# EasyEDA Pro project ProProject_阵列式磁场检测仪_2024-06-02.epro, board PCB1
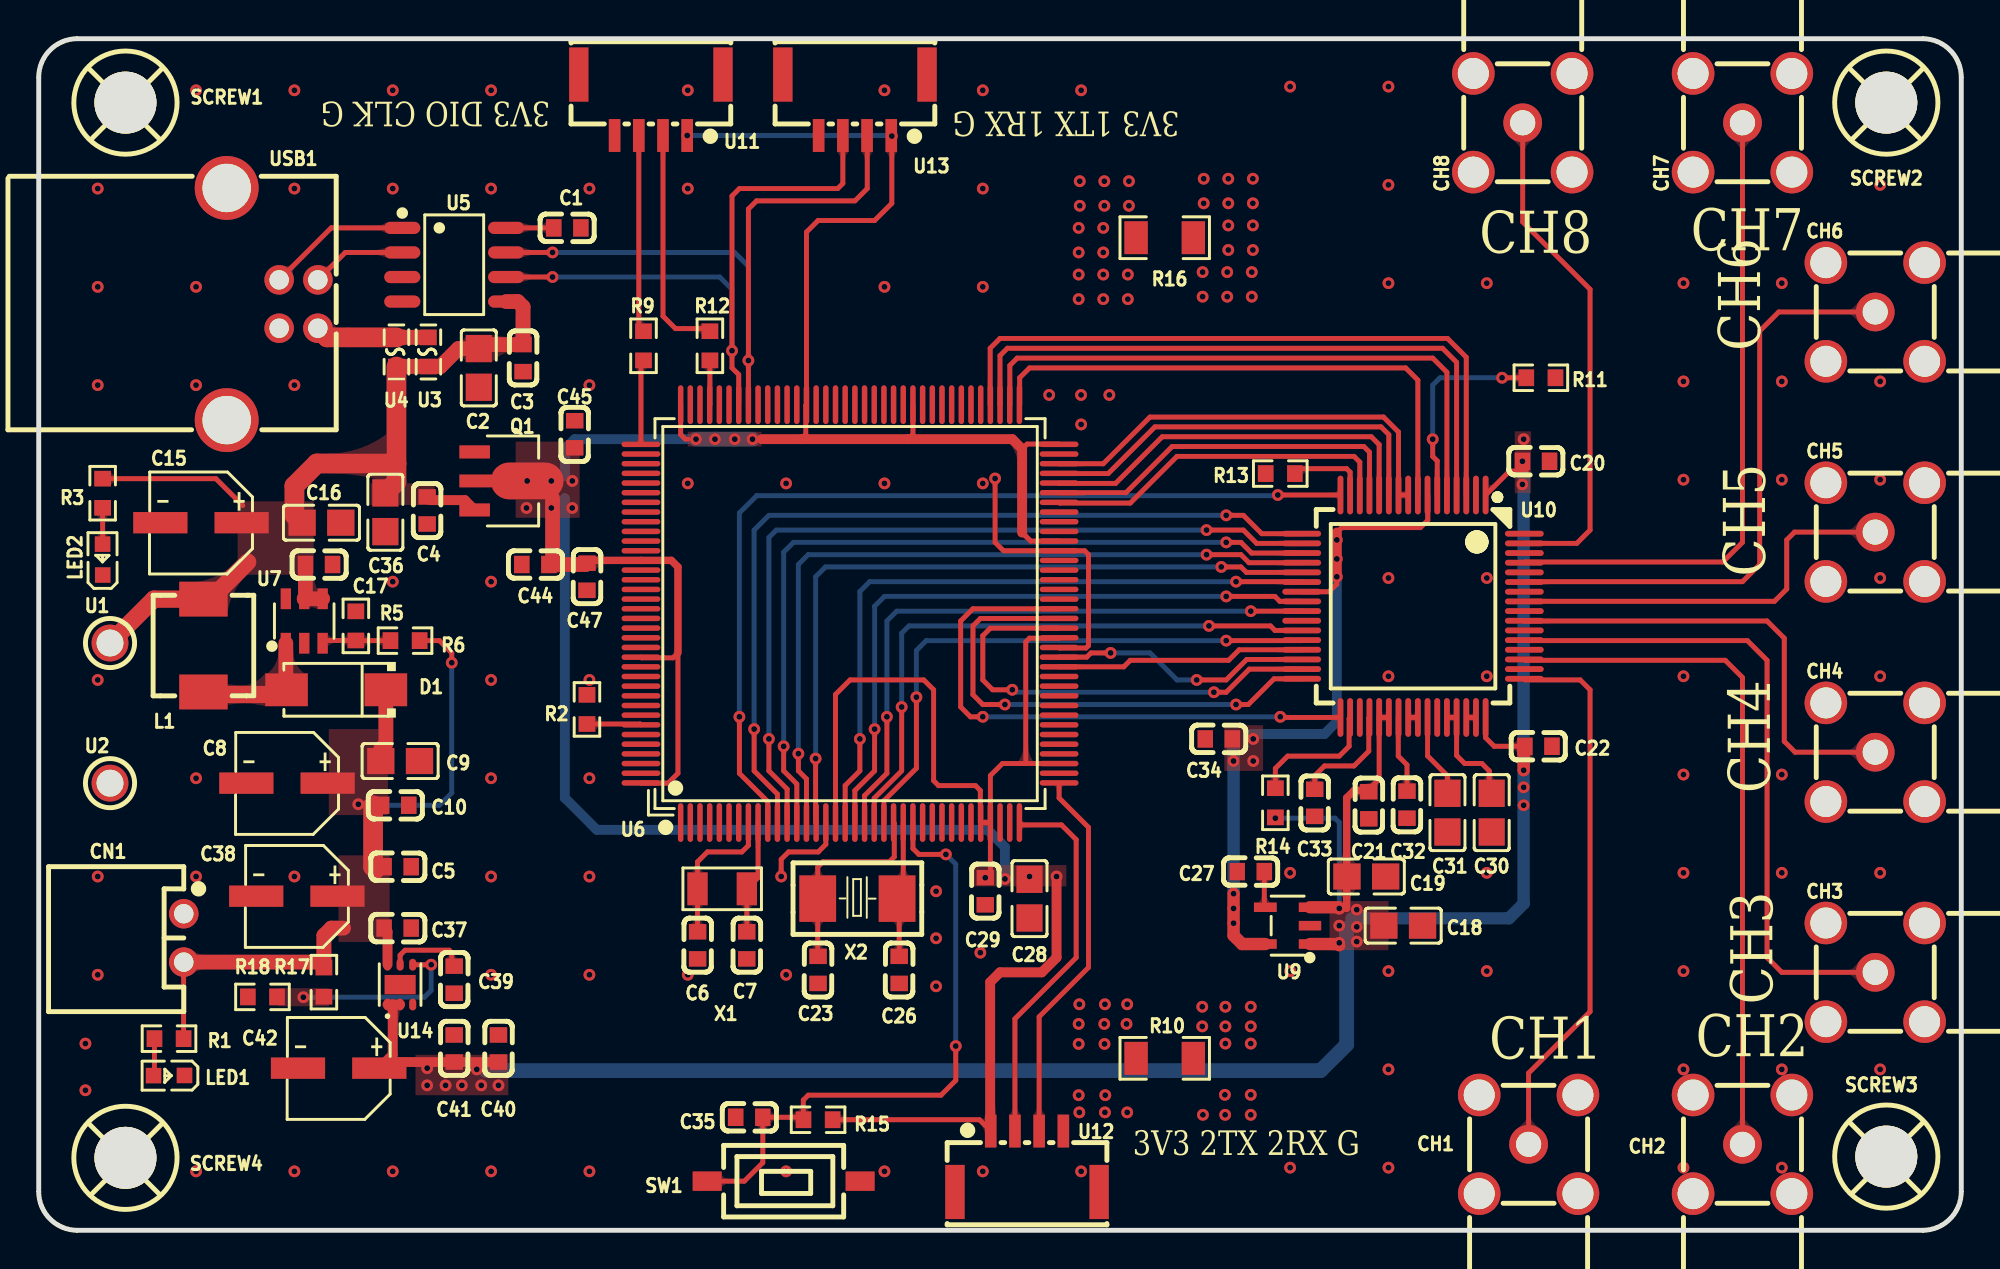
[diagram p6: board, top side]
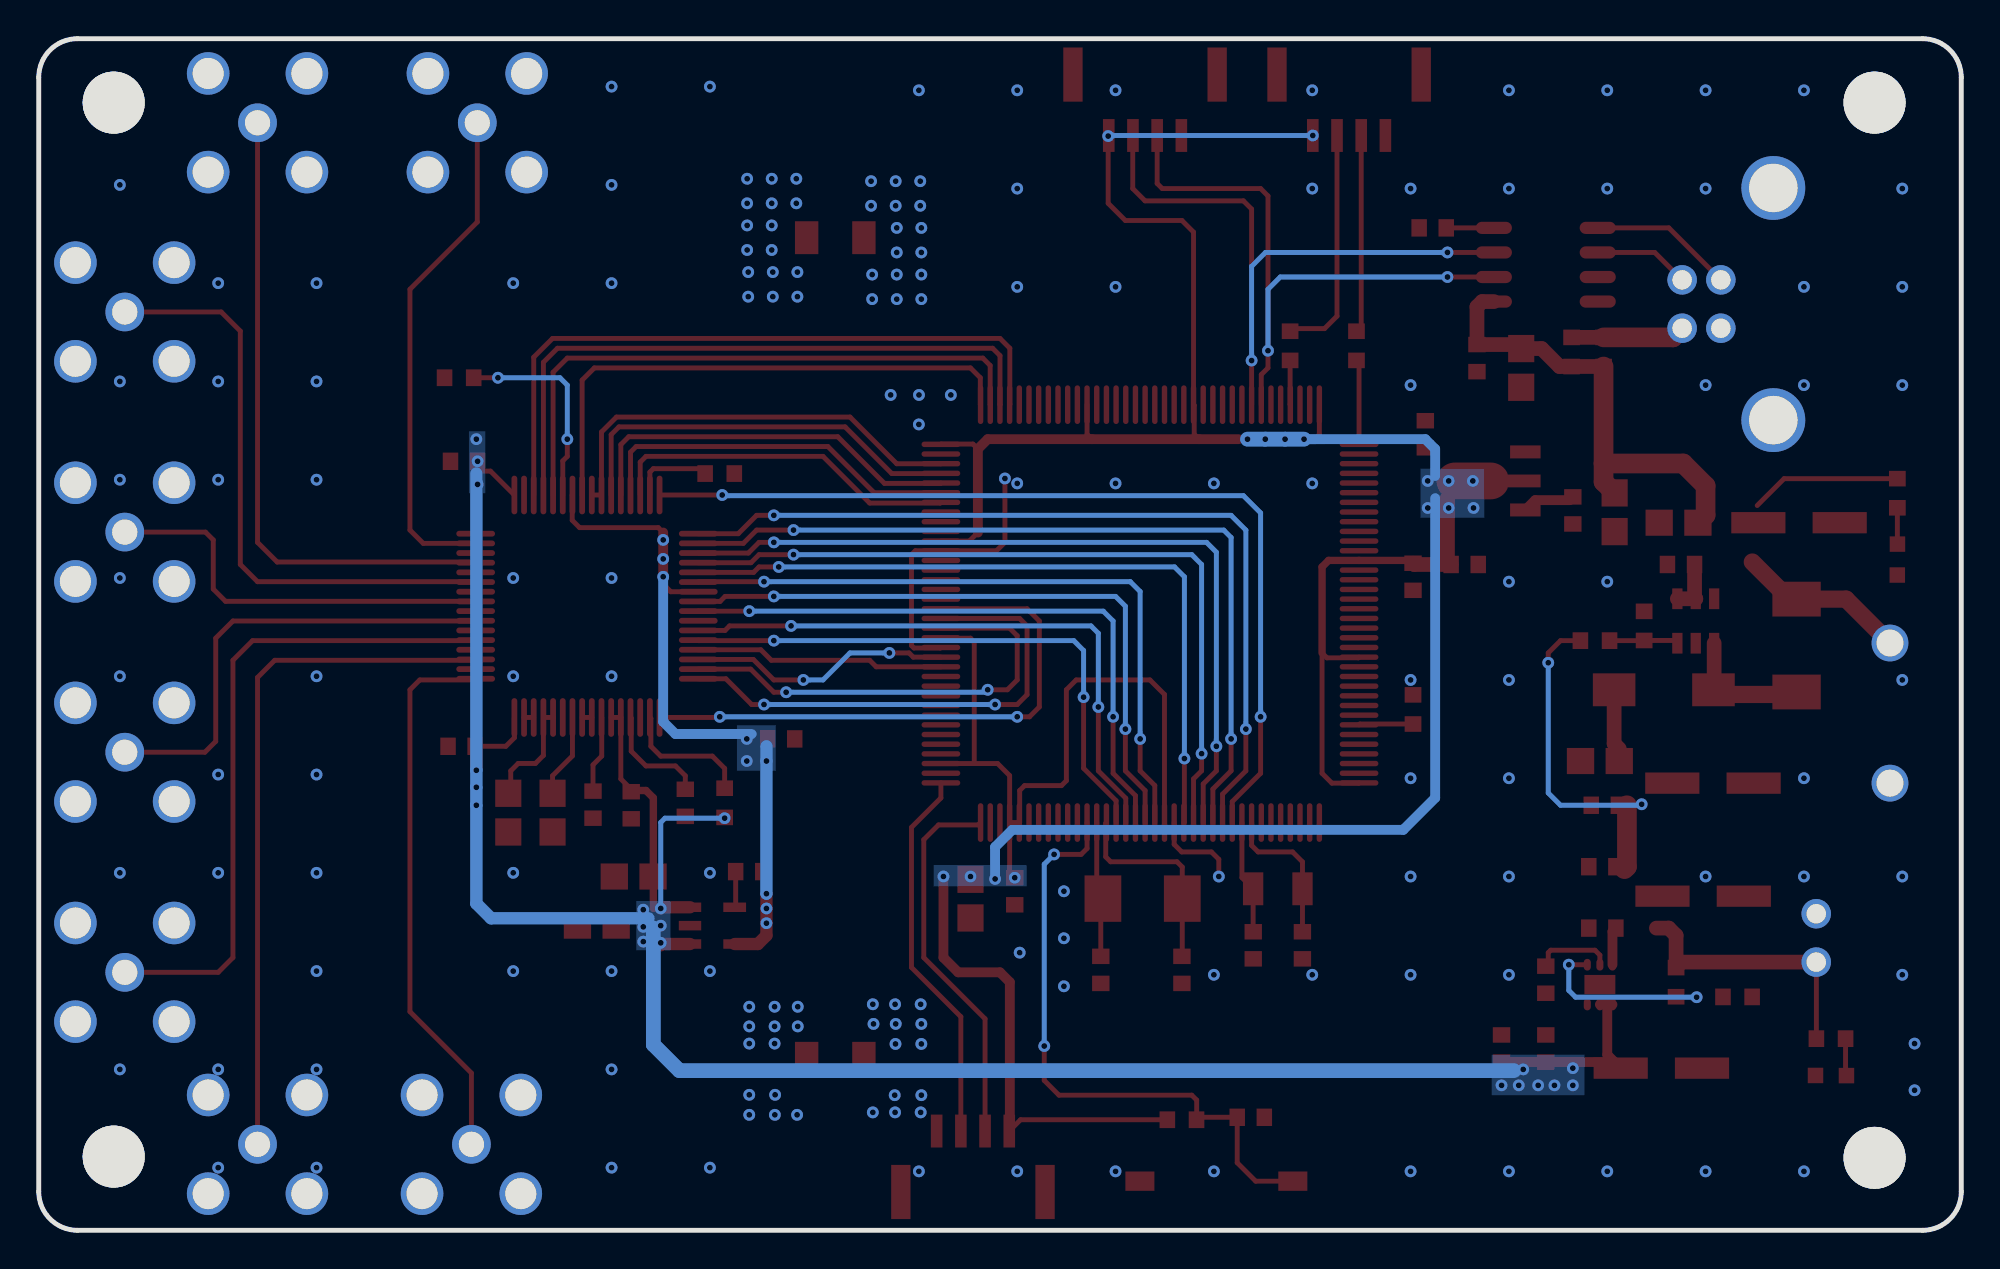
[diagram p7: board, bottom side, seen from below]

Outline 99.31 x 61.59 mm; copper layers: Top Layer, Bottom Layer. Coordinates in mm from the lower left corner of the outline.
Outline path: 0,59.59 0,2 arc(0.59,0.59) 2,0 97.31,0 arc(98.73,0.59) 99.31,2 99.31,59.59 arc(98.73,61.01) 97.31,61.59 2,61.59 arc(0.59,61.01) 0,59.59
Stack: Top Layer 0.035mm / Dielectric1 1.51mm FR4 er 4.5 / Bottom Layer 0.035mm

## Design rules (mm)
template: 自定义配置
spacing copperThickness1oz (default): track to track 0.102, other pairs 0.152 to 0.3
spacing copperThickness2oz: track to track 0.203, other pairs 0.152 to 0.3
track width copperThickness1oz (default): min 0.127, default 0.254, max 2.54
track width copperThickness2oz: min 0.203, default 0.254, max 2.54
differential pair differentialPair (default): width min 0.127, default 0.254, max 2.54; gap min 0.152, default 0.152
via viaSize (default): diameter min 0.5, default 0.61, max 10; hole min 0.3, default 0.305, max 6.3

## Placement (name value [footprint] x y rotation side)
C1  100nF  [C0603]  27.31 51.82 0 top
C2  10uF  [C0805]  22.73 44.58 270 top
C3  100nF  [C0603]  25.02 45.09 270 top
C4  100nF  [C0603]  20.07 37.21 90 top
C5  2.2uF  [C0603]  18.54 18.8 180 top
C6  6pF  [c0603]  34.04 14.73 270 top
C7  6pF  [C0603]  36.58 14.73 270 top
C8  22uF  [CAP-SMD_BD5.0-L5.3-W5.3-LS6.0-FD]  12.83 23.11 180 top
C9  10uF  [C0805]  18.67 24.26 180 top
C10  100nF  [C0603]  18.42 21.97 180 top
C15  22uF  [CAP-SMD_BD5.0-L5.3-W5.3-LS6.0-FD]  8.38 36.58 180 top
C16  10uF  [C0805]  14.61 36.58 0 top
C17  100nF  [C0603]  14.48 34.42 180 top
C18  10uF  [C0805]  70.49 15.75 180 top
C19  10uF  [C0805]  68.58 18.29 180 top
C20  100nF  [C0603]  77.34 39.75 0 top
C21  100nF  [C0603]  68.71 21.97 270 top
C22  100nF  [C0603]  77.47 25.02 0 top
C23  22pF  [C0603]  40.26 13.46 90 top
C26  22pF  [C0603]  44.45 13.46 90 top
C27  22nF  [C0603]  62.61 18.54 0 top
C28  10uF  [C0805]  51.18 17.15 270 top
C29  100nF  [C0603]  48.9 17.53 270 top
C30  10uF  [C0805]  75.06 21.59 90 top
C31  10uF  [C0805]  72.77 21.59 90 top
C32  100nF  [C0603]  70.68 22 90 top
C33  100nF  [C0603]  65.91 22.1 90 top
C34  100nF  [C0603]  60.96 25.4 0 top
C35  100nF  [C0603]  36.7 5.84 180 top
C36  10uF  [C0805]  17.91 37.12 270 top
C37  100nF  [C0603]  18.54 15.62 180 top
C38  10uF  [CAP-SMD_BD5.0-L5.3-W5.3-FD]  13.33 17.27 180 top
C39  1nF  [C0603]  21.46 12.95 270 top
C40  100nF  [C0603]  23.75 9.4 270 top
C41  2.2uF  [C0603]  21.46 9.4 270 top
C42  10uF  [CAP-SMD_BD5.0-L5.3-W5.3-FD]  15.49 8.38 180 top
C44  100nF  [C0603]  25.65 34.42 180 top
C45  100nF  [C0603]  27.69 41.15 90 top
C47  100nF  [C0603]  28.32 33.78 270 top
CH1  BWSMA-KWE-Z001  [SMA-TH_BWSMA-KWE-Z001]  76.96 4.44 270 top
CH2  BWSMA-KWE-Z001  [SMA-TH_BWSMA-KWE-Z001]  88.01 4.44 270 top
CH3  BWSMA-KWE-Z001  [SMA-TH_BWSMA-KWE-Z001]  94.87 13.34 0 top
CH4  BWSMA-KWE-Z001  [SMA-TH_BWSMA-KWE-Z001]  94.87 24.71 0 top
CH5  BWSMA-KWE-Z001  [SMA-TH_BWSMA-KWE-Z001]  94.87 36.09 0 top
CH6  BWSMA-KWE-Z001  [SMA-TH_BWSMA-KWE-Z001]  94.87 47.47 0 top
CH7  BWSMA-KWE-Z001  [SMA-TH_BWSMA-KWE-Z001]  88.01 57.25 90 top
CH8  BWSMA-KWE-Z001  [SMA-TH_BWSMA-KWE-Z001]  76.66 57.25 90 top
CN1  XH2.54-2P_H弯针插座  [CONN-TH_2P-P2.5_XH2.54-2P_H]  7.49 15.11 270 top
D1  SS14  [SMA_L4.2-W2.6-LS5.3-RD]  15.37 27.94 180 top
L1  15uH  [IND-SMD_L5.2-W5.2_YSPI0530]  8.51 30.23 270 top
LED1  KT-0603R  [LED0603-RD]  6.73 8 180 top
LED2  KT-0603R  [LED0603-RD]  3.3 34.67 90 top
Q1  AMS1117-3.3V  [SOT-89-3_L4.5-W2.5-P1.50-LS4.2-BR]  23.88 38.73 180 top
R1  24kΩ  [R0603]  6.73 9.91 0 top
R2  10kΩ  [R0603]  28.32 26.92 90 top
R3  10K  [R0603]  3.3 38.1 270 top
R5  1kΩ  [R0603]  16.38 31.24 270 top
R6  14kΩ  [R0603]  18.92 30.48 0 top
R9  51Ω  [R0603]  31.24 45.72 90 top
R10  0Ω  [R1206]  58.17 8.89 180 top
R11  10kΩ  [R0603]  77.6 44.07 180 top
R12  51Ω  [R0603]  34.67 45.72 90 top
R13  10kΩ  [R0603]  64.13 39.12 0 top
R14  10kΩ  [R0603]  63.88 22.1 270 top
R15  10kΩ  [R0603]  40.26 5.72 0 top
R16  0Ω  [R1206]  58.17 51.31 180 top
R17  150kΩ  [R0603]  14.73 12.83 270 top
R18  24kΩ  [R0603]  11.56 12.06 180 top
SCREW1  -  [M3螺丝]  4.54 58.23 0 top
SCREW2  -  [M3螺丝]  95.5 58.23 0 top
SCREW3  -  [M3螺丝]  95.5 3.75 0 top
SCREW4  -  [M3螺丝]  4.54 3.68 0 top
SW1  TS-1092S-B3D2-G  [SW-SMD_L6.1-W3.6-LS7.9]  38.48 2.54 180 top
U1  5003  [TEST-TH_BD2.54-P1.39]  3.68 30.36 0 top
U2  5003  [TEST-TH_BD2.54-P1.39]  3.68 23.11 0 top
U3  0467.250NRHF  [F0603]  20.13 45.4 270 top
U4  0467.250NRHF  [F0603]  18.48 45.4 270 top
U5  CH340N  [SOP-8_L4.9-W3.9-P1.27-LS6.0-BL]  21.46 49.91 270 top
U6  STM32F103ZET6  [LQFP-144_L20.0-W20.0-P0.50-LS22.0-BL]  41.91 31.88 0 top
U7  MT3608  [SOT-23-6_L2.9-W1.6-P0.95-LS2.8-BL]  13.72 31.5 0 top
U9  RT9193-33GB  [SOT-23-5_L3.0-W1.7-P0.95-LS2.8-BL]  64.52 15.75 90 top
U10  AD7606BSTZ  [LQFP-64_L10.0-W10.0-P0.50-LS12.0-BL]  70.99 32.26 180 top
U11  WAFER-GH1.25-4PWB  [CONN-SMD_4P-P1.25_XUNPU_WAFER-GH1.25-4PWB]  31.62 58.17 180 top
U12  WAFER-GH1.25-4PWB  [CONN-SMD_4P-P1.25_XUNPU_WAFER-GH1.25-4PWB]  51.05 3.56 0 top
U13  WAFER-GH1.25-4PWB  [CONN-SMD_4P-P1.25_XUNPU_WAFER-GH1.25-4PWB]  42.16 58.17 180 top
U14  SGM2211-5.0XTDI6G/TR  [TDFN-6_L2.0-W2.0-P0.65-BL-EP]  18.67 12.7 0 top
USB1  USB-B01  [USB-B-TH_USB-B01]  12.06 47.88 90 top
X1  32.768kHz  [crystal-smd_l3.2-w1.5-1]  35.31 17.65 180 top
X2  8MHz  [CRYSTAL-SMD_L5.0-W3.2]  42.29 17.15 180 top

## Footprints (pads in the part's own frame, mm; a bottom-side part is the same pattern mirrored in y, then rotated)
C0603
  rect 0.8x0.9 smd: 1(-0.7,0) 2(0.7,0)
c0603
  rect 0.8x0.9 smd: 1(-0.7,0) 2(0.7,0)
C0805
  rect 1.41x1.35 smd: 1(-1,0) 2(1,0)
CAP-SMD_BD5.0-L5.3-W5.3-FD
  rect 2.8x1.1 smd: 1(-2.1,0) 2(2.1,0)
CAP-SMD_BD5.0-L5.3-W5.3-LS6.0-FD
  rect 2.8x1.1 smd: 1(-2.1,0) 2(2.1,0)
CONN-SMD_4P-P1.25_XUNPU_WAFER-GH1.25-4PWB
  rect 0.6x1.7 smd: 1(-1.875,1.575) 2(-0.625,1.575) 3(0.625,1.575) 4(1.875,1.575)
  rect 1x2.8 smd: 5(3.725,-1.575) 6(-3.725,-1.575)
CONN-TH_2P-P2.5_XH2.54-2P_H
  round 1.524 hole 1: 1(-1.25,0) 2(1.25,0)
crystal-smd_l3.2-w1.5-1
  rect 1.05x1.7 smd: 1(-1.275,0) 2(1.275,0)
CRYSTAL-SMD_L5.0-W3.2
  rect 1.9x2.4 smd: 1(-2.05,0) 2(2.05,0)
F0603
  rect 0.806x0.864 smd: 1(-0.753,0) 2(0.753,0)
IND-SMD_L5.2-W5.2_YSPI0530
  rect 1.8x2.5 smd: 1(-2.4,0) 2(2.4,0)
LED0603-RD
  rect 0.8x0.8 smd: 1(-0.799,-0.004) 2(0.799,0.004)
LQFP-64_L10.0-W10.0-P0.50-LS12.0-BL
  oval 0.3x2 smd: 1(-3.75,-5.75) 2(-3.25,-5.75) 3(-2.75,-5.75) 4(-2.25,-5.75) 5(-1.75,-5.75) 6(-1.25,-5.75) 7(-0.75,-5.75) 8(-0.25,-5.75) 9(0.25,-5.75) 10(0.75,-5.75) 11(1.25,-5.75) 12(1.75,-5.75) 13(2.25,-5.75) 14(2.75,-5.75) 15(3.25,-5.75) 16(3.75,-5.75) 33(3.75,5.75) 34(3.25,5.75) 35(2.75,5.75) 36(2.25,5.75) 37(1.75,5.75) 38(1.25,5.75) 39(0.75,5.75) 40(0.25,5.75) 41(-0.25,5.75) 42(-0.75,5.75) 43(-1.25,5.75) 44(-1.75,5.75) 45(-2.25,5.75) 46(-2.75,5.75) 47(-3.25,5.75) 48(-3.75,5.75)
  oval 2x0.3 smd: 17(5.75,-3.75) 18(5.75,-3.25) 19(5.75,-2.75) 20(5.75,-2.25) 21(5.75,-1.75) 22(5.75,-1.25) 23(5.75,-0.75) 24(5.75,-0.25) 25(5.75,0.25) 26(5.75,0.75) 27(5.75,1.25) 28(5.75,1.75) 29(5.75,2.25) 30(5.75,2.75) 31(5.75,3.25) 32(5.75,3.75) 49(-5.75,3.75) 50(-5.75,3.25) 51(-5.75,2.75) 52(-5.75,2.25) 53(-5.75,1.75) 54(-5.75,1.25) 55(-5.75,0.75) 56(-5.75,0.25) 57(-5.75,-0.25) 58(-5.75,-0.75) 59(-5.75,-1.25) 60(-5.75,-1.75) 61(-5.75,-2.25) 62(-5.75,-2.75) 63(-5.75,-3.25) 64(-5.75,-3.75)
LQFP-144_L20.0-W20.0-P0.50-LS22.0-BL
  oval 0.28x2 smd: 1(-8.75,-10.8) 2(-8.25,-10.8) 3(-7.75,-10.8) 4(-7.25,-10.8) 5(-6.75,-10.8) 6(-6.25,-10.8) 7(-5.75,-10.8) 8(-5.25,-10.8) 9(-4.75,-10.8) 10(-4.25,-10.8) 11(-3.75,-10.8) 12(-3.25,-10.8) 13(-2.75,-10.8) 14(-2.25,-10.8) 15(-1.75,-10.8) 16(-1.25,-10.8) 17(-0.75,-10.8) 18(-0.25,-10.8) 19(0.25,-10.8) 20(0.75,-10.8) 21(1.25,-10.8) 22(1.75,-10.8) 23(2.25,-10.8) 24(2.75,-10.8) 25(3.25,-10.8) 26(3.75,-10.8) 27(4.25,-10.8) 28(4.75,-10.8) 29(5.25,-10.8) 30(5.75,-10.8) 31(6.25,-10.8) 32(6.75,-10.8) 33(7.25,-10.8) 34(7.75,-10.8) 35(8.25,-10.8) 36(8.75,-10.8) 73(8.75,10.8) 74(8.25,10.8) 75(7.75,10.8) 76(7.25,10.8) 77(6.75,10.8) 78(6.25,10.8) 79(5.75,10.8) 80(5.25,10.8) 81(4.75,10.8) 82(4.25,10.8) 83(3.75,10.8) 84(3.25,10.8) 85(2.75,10.8) 86(2.25,10.8) 87(1.75,10.8) 88(1.25,10.8) 89(0.75,10.8) 90(0.25,10.8) 91(-0.25,10.8) 92(-0.75,10.8) 93(-1.25,10.8) 94(-1.75,10.8) 95(-2.25,10.8) 96(-2.75,10.8) 97(-3.25,10.8) 98(-3.75,10.8) 99(-4.25,10.8) 100(-4.75,10.8) 101(-5.25,10.8) 102(-5.75,10.8) 103(-6.25,10.8) 104(-6.75,10.8) 105(-7.25,10.8) 106(-7.75,10.8) 107(-8.25,10.8) 108(-8.75,10.8)
  oval 2x0.28 smd: 37(10.8,-8.75) 38(10.8,-8.25) 39(10.8,-7.75) 40(10.8,-7.25) 41(10.8,-6.75) 42(10.8,-6.25) 43(10.8,-5.75) 44(10.8,-5.25) 45(10.8,-4.75) 46(10.8,-4.25) 47(10.8,-3.75) 48(10.8,-3.25) 49(10.8,-2.75) 50(10.8,-2.25) 51(10.8,-1.75) 52(10.8,-1.25) 53(10.8,-0.75) 54(10.8,-0.25) 55(10.8,0.25) 56(10.8,0.75) 57(10.8,1.25) 58(10.8,1.75) 59(10.8,2.25) 60(10.8,2.75) 61(10.8,3.25) 62(10.8,3.75) 63(10.8,4.25) 64(10.8,4.75) 65(10.8,5.25) 66(10.8,5.75) 67(10.8,6.25) 68(10.8,6.75) 69(10.8,7.25) 70(10.8,7.75) 71(10.8,8.25) 72(10.8,8.75) 109(-10.8,8.75) 110(-10.8,8.25) 111(-10.8,7.75) 112(-10.8,7.25) 113(-10.8,6.75) 114(-10.8,6.25) 115(-10.8,5.75) 116(-10.8,5.25) 117(-10.8,4.75) 118(-10.8,4.25) 119(-10.8,3.75) 120(-10.8,3.25) 121(-10.8,2.75) 122(-10.8,2.25) 123(-10.8,1.75) 124(-10.8,1.25) 125(-10.8,0.75) 126(-10.8,0.25) 127(-10.8,-0.25) 128(-10.8,-0.75) 129(-10.8,-1.25) 130(-10.8,-1.75) 131(-10.8,-2.25) 132(-10.8,-2.75) 133(-10.8,-3.25) 134(-10.8,-3.75) 135(-10.8,-4.25) 136(-10.8,-4.75) 137(-10.8,-5.25) 138(-10.8,-5.75) 139(-10.8,-6.25) 140(-10.8,-6.75) 141(-10.8,-7.25) 142(-10.8,-7.75) 143(-10.8,-8.25) 144(-10.8,-8.75)
M3螺丝
  round 3.2 hole 3.2: 1(-0.064,0.064)
R0603
  rect 0.806x0.864 smd: 1(-0.753,0) 2(0.753,0)
R1206
  rect 1.208x1.701 smd: 1(-1.479,0) 2(1.479,0)
SMA-TH_BWSMA-KWE-Z001
  round 2.2 hole 1.6: 1(-2.55,-2.55) 2(-2.55,2.55) 3(2.55,2.55) 4(2.55,-2.55)
  round 2 hole 1.3: 5(0,0)
SMA_L4.2-W2.6-LS5.3-RD
  rect 2.2x1.7 smd: 1(-2.566,0) 2(2.566,0)
SOP-8_L4.9-W3.9-P1.27-LS6.0-BL
  oval 0.63x1.865 smd: 1(-1.905,-2.683) 2(-0.635,-2.683) 3(0.635,-2.683) 4(1.905,-2.683) 5(1.905,2.683) 6(0.635,2.683) 7(-0.635,2.683) 8(-1.905,2.683)
SOT-23-5_L3.0-W1.7-P0.95-LS2.8-BL
  rect 0.49x1.157 smd: 1(-0.95,-1.153) 2(0,-1.153) 3(0.95,-1.153)
  rect 0.49x1.175 smd: 4(0.95,1.153) 5(-0.95,1.153)
SOT-23-6_L2.9-W1.6-P0.95-LS2.8-BL
  rect 0.532x1.072 smd: 1(-0.95,-1.149) 2(0,-1.149) 3(0.95,-1.149) 4(0.95,1.149) 5(0,1.149) 6(-0.95,1.149)
SOT-89-3_L4.5-W2.5-P1.50-LS4.2-BR
  rect 1.575x0.672 smd: 1(1.356,-1.5) 3(1.356,1.5)
  custom 5.377x1.9 smd: 2(-1.356,0)
SW-SMD_L6.1-W3.6-LS7.9
  rect 1.5x1 smd: 1(-3.95,0) 2(3.95,0)
TDFN-6_L2.0-W2.0-P0.65-BL-EP
  oval 0.364x0.607 smd: 1(-0.65,-1.028) 2(0,-1.028) 3(0.65,-1.028) 4(0.65,1.028) 5(0,1.028) 6(-0.65,1.028)
  rect 1.6x1 smd: 7(0,0)
TEST-TH_BD2.54-P1.39
  round 1.9 hole 1.39: 1(0,0)
USB-B-TH_USB-B01
  round 1.524 hole 1: 1(-1.25,-2.355) 2(1.25,-2.355) 3(1.25,-0.355) 4(-1.25,-0.355)
  round 3.3 hole 2.5: 5(-6,2.355) 6(6,2.355)

## Nets
As in the schematic.

Pads without a net: R13 1; SCREW1 1; SCREW2 1; SCREW3 1; SCREW4 1; U5 4; U6 1 2 3 4 5 6 7 26 27 28 29 34 40 41 42 43 44 45 47 48 56 57 58 59 60 63 64 65 77 78 79 80 81 82 85 86 87 88 89 90 91 92 93 96 97 98 99 100 103 104 106 110 111 112 113 114 115 116 117 118 119 122 123 124 125 126 127 128 129 132 133 134 135 136 137 139 140 141 142; U7 6

## Via types
v1: diameter 0.61, hole 0.305, Top Layer to Bottom Layer, 251 vias

## Routing (per net, layer and track width the routed paths; a pad name or vN(x,y) marks a point on that pad's centre or on a via; arc(x,y) is an arc through that point)
9V: length 36.9
  Top Layer w0.254: v1(21.34,29.34) 21.34,29.84 20.7,30.48 R6.2 ; R1.2 7.48,13.85 CN1.2
  Top Layer w0.508: 18.02,13.73 18.02,15.44 C37.2
  Top Layer w0.762: CN1.2 14.45,13.86 R17.1 14.73,15.24 15.11,15.62 15.75,15.62 ; 17.67,24.89 17.93,25.16 D1.1
  Top Layer w1.016: 17.27,21.97 17.27,18.8 17.4,18.67
  Bottom Layer w0.254: v1(21.34,29.34) 21.34,22.61 20.7,21.97 16.56,21.97 v1(16.51,22.02)
+5V: length 46.7
  Top Layer w0.254: R3.1 9.15,38.85 10.54,37.47
  Top Layer w0.508: C4.2 20.23,37.74 22.01,37.74 Q1.3
  Top Layer w0.762: U4.2 U3.2 20.75,44.65 21.68,45.58 C2.1 22.94,45.79 C3.1 25.02,47.74 24.75,48.01 U5.5 ; C17.2 13.78,32.71 U7.5 U7.4
  Top Layer w0.889: 10.8,34.54 8.88,32.63 L1.1 5.95,32.63 U1.1
  Top Layer w1.016: 18.48,39.64 18.48,38.69 C36.1 ; 18.48,39.64 14.36,39.64 13.21,38.48 13.21,36.97 C16.1 ; 18.48,39.64 U4.2
A3V3: length 34.8
  Top Layer w0.254: U10.7 71.75,38 71.75,36.7 71.37,36.32 67.31,36.32 67.06,36.07 ; v1(67.06,33.78) 67.06,33.4 66.66,33.01 U10.23
  Top Layer w0.508: v1(67.06,33.78) v1(67.06,34.7) v1(67.06,35.69) 67.06,36.07
  Top Layer w0.635: v1(61.72,17.4) v1(61.72,16.64) v1(61.72,15.88) 61.72,15.24 62.16,14.8 U9.5
  Bottom Layer w0.508: 62.48,25.65 66.42,25.65 67.06,26.29 v1(67.06,33.78)
  Bottom Layer w0.635: v1(61.72,17.4) v1(61.72,24.26) 61.72,25.02
  vias: v1(62.74,25.4) v1(62.74,24.26)
AGND: length 1
  Top Layer w0.254: U10.40 U10.41 ; U10.47 U10.46
  vias: v1(60.12,49.53) v1(60.12,48.26) v1(60.1,11.56) v1(60.1,10.54) v1(60.14,5.97) v1(60.18,54.36) v1(60.18,53.09) v1(61.3,11.56) v1(61.3,10.54) v1(61.3,9.65) v1(61.27,7) v1(61.29,5.97) v1(61.45,54.36) v1(61.45,53.09) v1(61.45,51.94) v1(61.45,50.67) v1(61.39,49.53) v1(61.39,48.26) v1(62.61,11.56) v1(62.61,10.54) v1(62.61,9.65) v1(62.61,7) v1(62.61,5.97) v1(62.72,54.36) v1(62.72,53.09) v1(62.72,51.94) v1(62.72,50.67) v1(62.66,49.53) v1(62.66,48.26) v1(64.64,59.12) v1(64.64,18.48) v1(64.64,13.4) v1(64.64,3.24) v1(69.72,59.12) v1(69.72,54.04) v1(69.72,48.96) v1(69.72,33.72) v1(69.72,28.64) v1(69.72,13.4) v1(69.72,8.32) v1(69.72,3.24) v1(74.8,48.96) v1(74.8,33.72) v1(74.8,28.64) v1(74.8,18.48) v1(74.8,13.4) v1(84.96,48.96) v1(84.96,43.88) v1(84.96,38.8) v1(84.96,28.64) v1(84.96,23.56) v1(84.96,18.48) v1(84.96,13.4) v1(84.96,8.32) v1(84.96,3.24) v1(90.04,48.96) v1(90.04,43.88) v1(90.04,38.8) v1(90.04,23.56) v1(90.04,18.48) v1(90.04,8.32) v1(90.04,3.24) v1(95.12,54.04) v1(95.12,43.88) v1(95.12,38.8) v1(95.12,33.72) v1(95.12,28.64) v1(95.12,18.48) v1(95.12,8.32)
AVCC: length 122
  Top Layer w0.254: U10.48 74.74,25.46 75.18,25.02 C22.1 ; 68.65,22.73 69.24,23.33 U10.37 U10.38 ; U10.1 75.98,39.24 76.84,39.24
  Top Layer w0.381: C21.1 68.65,22.73 67.94,22.73 67.56,22.35 67.56,16.64
  Top Layer w0.508: 17.91,8.7 C41.2 C40.2 ; 17.91,8.7 C42.1 ; 17.91,8.7 18.29,9.08 18.29,11.67 ; 18.02,11.67 18.29,11.67 ; 18.29,11.67 U14.2
  Top Layer w0.635: U9.3 67.12,16.7 v1(67.18,16.64) ; U9.1 67.12,14.8 67.18,14.73 ; v1(76.71,23.78) 76.71,24.95
  Bottom Layer w0.254: v1(67.18,16.64) 67.18,21.08 66.96,21.3 v1(63.88,21.3)
  Bottom Layer w0.635: 76.71,39.12 v1(76.71,23.78) v1(76.71,22.9) v1(76.71,21.97) 76.71,16.89 75.95,16.13 67.82,16.13
  Bottom Layer w0.762: 23.11,8.26 66.22,8.26 67.56,9.6 67.56,15.62
  vias: v1(20.07,8.38) v1(20.07,7.49) v1(21.02,7.49) v1(21.86,7.49) v1(22.63,8.32) v1(22.86,7.49) v1(23.75,7.49) v1(67.18,15.75) v1(67.18,14.86) v1(68.09,16.57) v1(68.09,15.68) v1(68.09,14.92) v1(76.64,39.75) v1(76.64,38.56) v1(76.71,40.89)
GND: length 19.2
  Top Layer w0.254: U6.16 40.66,19.95 40.27,19.56 38.74,19.56 38.35,19.18 38.35,18.42 ; U6.51 52.74,30.1 54.1,30.1 54.23,30.23 54.23,34.92 54.03,35.13 U6.61 49.84,35.13 49.4,35.56 v1(49.4,38.86)
  vias: v1(2.41,9.65) v1(2.41,7.24) v1(3.05,53.85) v1(3.05,48.77) v1(3.05,43.69) v1(3.05,28.45) v1(3.05,18.29) v1(3.05,13.21) v1(8.13,58.93) v1(8.13,48.77) v1(8.13,43.69) v1(8.13,23.37) v1(8.13,18.29) v1(8.13,3.05) v1(13.21,58.93) v1(13.21,53.85) v1(13.21,43.69) v1(13.21,18.29) v1(13.21,3.05) v1(18.29,58.93) v1(18.29,53.85) v1(18.29,33.53) v1(18.29,3.05) v1(23.37,58.93) v1(23.37,53.85) v1(23.37,33.53) v1(23.37,28.45) v1(23.37,23.37) v1(23.37,18.29) v1(23.37,13.21) v1(23.37,3.05) v1(28.45,53.85) v1(28.45,43.69) v1(28.45,28.45) v1(28.45,23.37) v1(28.45,18.29) v1(28.45,13.21) v1(28.45,3.05) v1(33.53,58.93) v1(33.53,53.85) v1(33.53,38.61) v1(33.53,13.21) v1(38.35,18.29) v1(38.61,38.61) v1(38.61,13.21) v1(38.61,3.05) v1(43.69,58.93) v1(43.69,48.77) v1(43.69,38.61) v1(43.69,3.05) v1(46.35,17.53) v1(46.35,15.1) v1(46.35,12.61) v1(48.64,14.35) v1(48.77,58.93) v1(48.77,53.85) v1(48.77,48.77) v1(48.77,38.61) v1(48.77,3.05) v1(52.2,43.18) v1(53.72,51.82) v1(53.72,50.55) v1(53.72,49.4) v1(53.72,48.13) v1(53.72,10.67) v1(53.72,9.63) v1(53.72,6.98) v1(53.85,58.93) v1(53.78,54.23) v1(53.78,52.96) v1(53.84,43.18) v1(53.85,41.66) v1(53.75,11.68) v1(53.75,6.1) v1(53.85,3.05) v1(55.05,54.23) v1(55.05,52.96) v1(54.99,51.82) v1(54.99,50.55) v1(54.99,49.4) v1(54.99,48.13) v1(55.04,10.67) v1(55.08,11.68) v1(55.06,9.63) v1(55.1,6.98) v1(55.08,6.1) v1(55.31,43.18) v1(56.23,11.68) v1(56.19,10.67) v1(56.23,6.1) v1(56.32,54.23) v1(56.32,52.96) v1(56.26,49.4) v1(56.26,48.13)
VDD: length 196.6
  Top Layer w0.254: U6.144 31.12,23.11 32.51,23.11 33.02,23.62 33.02,29.84 32.77,29.59 31.15,29.59 U6.131 ; U6.108 33.16,41.14 33.4,40.89 33.53,40.89 ; v1(48.9,18.23) 49.16,18.49 U6.33 ; 39.37,40.89 39.62,41.15 39.62,42.64 U6.95 39.66,51.6 40.26,52.2 43.18,52.2 44.07,53.09 v1(44.07,56.56) U13.1 ; U6.52 52.69,30.61 51.18,30.61 50.99,30.41 50.99,24.13 ; 50.99,24.13 49.78,24.13 49.16,23.51 U6.33 ; 50.99,24.13 U6.39 ; U6.33 U6.32 48.64,21.1 48.64,22.73 48.39,22.99 46.48,22.99 46.23,23.24 46.23,27.94 45.72,28.45 41.91,28.45 41.16,27.7 U6.17 ; R15.2 48.59,5.72 49.15,5.16 ; U6.72 52.7,40.64 51.05,40.64 50.8,40.39 ; U6.84 45.16,41.15 44.91,40.89 ; 50.8,36.07 51.24,35.63 U6.62
  Top Layer w0.381: 33.02,29.84 33.02,34.29 32.68,34.63 U6.121 28.47,34.63 28.32,34.48
  Top Layer w0.508: v1(52.58,18.29) 52.58,14.1 51.82,13.34 49.66,13.34 49.15,12.83 49.15,5.16 U12.1 ; 50.8,36.07 50.8,40.39 50.29,40.89 37.34,40.89
  Top Layer w0.762: 28.32,34.48 28.26,34.42 C44.1 26.54,34.61 26.54,37.85
  Bottom Layer w0.254: v1(44.07,56.56) U13.1 v1(33.5,56.59)
  Bottom Layer w0.508: 27.18,37.85 27.18,22.35 28.83,20.7 49.02,20.7 49.91,19.81 v1(49.91,18.16) ; v1(33.95,40.89) 27.69,40.89 27.18,40.39 27.18,38.99
  Bottom Layer w0.762: v1(33.95,40.89) v1(34.93,40.89) v1(35.96,40.89) v1(36.87,40.89)
  vias: v1(25.23,38.73) v1(25.2,37.34) v1(26.48,38.73) v1(26.48,37.34) v1(27.56,38.73) v1(27.56,37.34) v1(51.18,18.29)
AD_RESET: length 21.3
  Top Layer w0.254: U6.69 52.72,39.12 55.25,39.12 57.66,41.53 69.34,41.53 69.74,41.13 U10.11
BUSY: length 18.4
  Top Layer w0.254: U10.14 68.24,39.71 67.94,40.01 58.8,40.01 56.39,37.59 52.75,37.59 U6.66
CH1: length 28.4
  Top Layer w0.254: CH1.5 76.96,8.13 80.14,11.3 80.14,27.94 79.63,28.45 76.8,28.45 U10.49
CH2: length 35.8
  Top Layer w0.254: U10.51 76.79,29.46 87.12,29.46 88.01,28.58 CH2.5
CH3: length 34.2
  Top Layer w0.254: U10.53 76.77,30.48 88.26,30.48 89.28,29.46 89.28,14.1 90.04,13.34 CH3.5
CH4: length 24.1
  Top Layer w0.254: CH4.5 90.73,24.71 90.17,25.27 90.17,30.61 89.28,31.5 76.75,31.5 U10.55
CH5: length 21.1
  Top Layer w0.254: CH5.5 90.7,36.09 90.3,35.69 90.3,33.15 89.66,32.51 76.75,32.51 U10.57
CH6: length 31
  Top Layer w0.254: CH6.5 89.89,47.47 88.9,46.48 88.9,34.42 88.01,33.53 76.76,33.53 U10.59
CH7: length 33.4
  Top Layer w0.254: CH7.5 88.01,35.56 87,34.54 76.78,34.54 U10.61
CH8: length 26.2
  Top Layer w0.254: U10.63 79.45,35.51 80.14,36.2 80.14,48.64 76.66,52.12 CH8.5
CONVST: length 22.6
  Top Layer w0.254: U10.9 U10.10 70.24,41.26 69.47,42.04 57.4,42.04 54.99,39.62 52.71,39.62 U6.70
CS: length 19.4
  Top Layer w0.254: U10.13 68.74,40.22 68.45,40.51 58.55,40.51 56.16,38.13 U6.67
D0: length 48
  Top Layer w0.254: U10.16 v1(64.01,38.01) ; U6.10 37.66,22.16 36.19,23.62 v1(36.19,26.54)
  Bottom Layer w0.254: v1(64.01,38.01) 63.97,37.97 37.08,37.97 36.19,37.08 v1(36.19,26.54)
D1: length 44.6
  Top Layer w0.254: U6.11 38.16,22.55 36.96,23.75 v1(36.96,25.91) ; v1(61.34,36.96) 62.23,36.96 63.18,36.01 U10.17
  Bottom Layer w0.254: v1(36.96,25.91) 36.96,36.2 37.72,36.96 v1(61.34,36.96)
D2: length 43.1
  Top Layer w0.254: v1(37.72,25.4) 37.72,23.75 38.66,22.81 U6.12 ; U10.18 62.92,35.51 62.23,36.2 v1(60.32,36.2)
  Bottom Layer w0.254: v1(60.32,36.2) 38.1,36.2 37.72,35.81 v1(37.72,25.4)
D3: length 41.5
  Top Layer w0.254: U10.19 62.66,35.01 62.1,35.56 v1(61.34,35.56) ; U6.13 39.16,23.07 38.48,23.75 v1(38.48,25.02)
  Bottom Layer w0.254: v1(61.34,35.56) 38.99,35.56 38.48,35.05 v1(38.48,25.02)
D4: length 39.9
  Top Layer w0.254: v1(39.24,24.64) 39.24,23.75 39.66,23.33 U6.14 ; v1(60.32,34.92) 62.1,34.92 62.52,34.51 U10.20
  Bottom Layer w0.254: v1(60.32,34.92) 39.75,34.92 39.24,34.42 v1(39.24,24.64)
D5: length 38.2
  Top Layer w0.254: v1(40.13,24.38) 40.13,21.11 U6.15 ; U10.21 62.38,34.01 62.1,34.29 v1(61.09,34.29)
  Bottom Layer w0.254: v1(40.13,24.38) 40.13,33.78 40.64,34.29 v1(61.09,34.29)
D6: length 35.3
  Top Layer w0.254: U6.18 41.66,22.99 42.42,23.75 v1(42.42,25.4) ; U10.22 65.22,33.53 v1(61.85,33.53)
  Bottom Layer w0.254: v1(42.42,25.4) 42.42,33.02 42.93,33.53 v1(61.85,33.53)
D7: length 34
  Top Layer w0.254: U10.24 64.12,32.51 63.86,32.77 v1(61.34,32.77) ; U6.19 42.16,22.73 43.18,23.75 v1(43.18,25.91)
  Bottom Layer w0.254: v1(43.18,25.91) 43.18,32.26 43.69,32.77 v1(61.34,32.77)
D8: length 32.5
  Top Layer w0.254: v1(62.61,32) 65.24,32 U10.25 ; v1(43.81,26.54) 43.81,23.62 42.66,22.47 U6.20
  Bottom Layer w0.254: v1(43.81,26.54) 43.81,31.5 44.32,32 v1(62.61,32)
D9: length 31.3
  Top Layer w0.254: v1(60.45,31.24) 63.63,31.24 63.86,31.01 U10.27 ; v1(44.58,27.05) 44.58,23.75 43.16,22.33 U6.21
  Bottom Layer w0.254: v1(60.45,31.24) 44.96,31.24 44.58,30.86 v1(44.58,27.05)
D10: length 29.7
  Top Layer w0.254: v1(61.34,30.48) 65.22,30.48 U10.28 ; v1(45.34,27.56) 45.34,23.88 43.66,22.2 U6.22
  Bottom Layer w0.254: v1(61.34,30.48) 45.85,30.48 45.34,29.97 v1(45.34,27.56)
D11: length 12.9
  Top Layer w0.254: U6.49 56.05,29.13 56.39,29.46 61.47,29.46 62.01,30.01 U10.29
D12: length 13.6
  Top Layer w0.254: v1(55.37,29.84) 54.36,29.84 54.14,29.63 U6.50 ; U10.30 62.4,29.51 61.34,28.45 v1(59.82,28.45)
  Bottom Layer w0.254: v1(55.37,29.84) 57.4,29.84 58.8,28.45 v1(59.82,28.45)
D13: length 23.6
  Top Layer w0.254: v1(50.29,27.94) 49.28,27.94 48.77,28.45 48.77,30.73 49.16,31.13 U6.53 ; v1(60.71,27.81) 61.34,27.81 62.54,29.01 U10.31
  Bottom Layer w0.254: v1(50.29,27.94) 50.42,27.81 v1(60.71,27.81)
D14: length 25.9
  Top Layer w0.254: v1(61.85,27.18) 62.48,27.18 63.81,28.51 U10.32 ; v1(49.91,27.18) 48.77,27.18 48.26,27.69 48.26,31.24 48.65,31.63 U6.54
  Bottom Layer w0.254: v1(49.91,27.18) v1(61.85,27.18)
D15: length 29.6
  Top Layer w0.254: U10.33 64.17,26.51 v1(64.13,26.54) ; v1(48.77,26.54) 48.13,26.54 47.62,27.05 47.62,31.5 48.26,32.13 U6.55
  Bottom Layer w0.254: v1(64.13,26.54) v1(48.77,26.54)
D+: length 7.5
  Top Layer w0.254: U5.1 15.11,51.82 USB1.3
D-: length 4.9
  Top Layer w0.254: U5.2 15.84,50.55 USB1.2
OS0: length 35.2
  Top Layer w0.254: U10.3 73.74,45.13 72.77,46.1 49.66,46.1 49.15,45.59 49.15,42.69 U6.76
OS1: length 33.4
  Top Layer w0.254: U6.75 49.66,42.68 49.66,45.21 50.04,45.59 72.52,45.59 73.24,44.87 U10.4
OS2: length 31.4
  Top Layer w0.254: U10.5 72.74,44.35 72.01,45.09 50.55,45.09 50.16,44.7 50.16,42.68 U6.74
RANGE: length 28.4
  Top Layer w0.254: U10.8 71.24,43.95 70.61,44.58 51.18,44.58 50.67,44.07 50.67,42.69 U6.73
RD: length 20.3
  Top Layer w0.254: U6.68 52.73,38.61 55.63,38.61 58.04,41.02 68.83,41.02 69.24,40.61 U10.12
RST: length 32.1
  Top Layer w0.254: v1(47.37,9.53) 47.37,7.75 46.61,6.98 39.75,6.98 39.5,6.73 39.5,5.72 ; 39.5,5.72 R15.1 ; 39.5,5.72 39.38,5.84 C35.1 37.4,3.49 36.45,2.54 SW1.2 ; v1(46.86,19.43) 45.47,19.43 45.16,19.74 U6.25
  Bottom Layer w0.254: v1(46.86,19.43) 47.37,18.92 v1(47.37,9.53)
SWCLK: length 10.2
  Top Layer w0.254: R9.2 31,46.72 U11.3
SWDIO: length 12.1
  Top Layer w0.254: R12.2 34.54,46.61 32.89,46.61 32.25,47.25 U11.2
UART1_RX: length 34.5
  Top Layer w0.254: U13.3 41.54,54.11 41.28,53.85 36.19,53.85 35.81,53.47 v1(35.81,45.47) 35.81,44.58 36.16,44.23 U6.102 ; v1(26.54,49.28) U5.6
  Bottom Layer w0.254: v1(35.81,45.47) 35.81,48.64 35.18,49.28 v1(26.54,49.28)
UART1_TX: length 37.1
  Top Layer w0.254: U13.2 42.8,56.58 42.8,53.85 42.16,53.21 37.08,53.21 36.66,52.79 v1(36.66,44.96) U6.101 ; v1(26.54,50.55) U5.7
  Bottom Layer w0.254: v1(36.66,44.96) 36.66,49.83 35.94,50.55 v1(26.54,50.55)
UART2_RX: length 19.7
  Top Layer w0.254: U6.37 52.71,22.35 54.23,20.83 54.23,13.59 51.68,11.04 U12.3
UART2_TX: length 19.7
  Top Layer w0.254: U12.2 50.43,10.93 53.59,14.1 53.59,20.19 52.83,20.95 50.78,20.95 U6.36
USB_5V: length 5.9
  Top Layer w0.762: U4.1 U3.1
  Top Layer w1.016: U4.1 14.89,46.16 USB1.1
$1N3529: length 10.8
  Top Layer w0.254: U10.6 72.24,39.77 72.01,40.01 v1(72.01,40.89) ; R11.2 v1(75.59,44.07)
  Bottom Layer w0.254: v1(72.01,40.89) 72.01,43.69 72.39,44.07 v1(75.59,44.07)
$1N3639: length 4.2
  Top Layer w0.254: R13.2 65.14,39.37 67.56,39.37 67.74,39.19 U10.15
$1N3819: length 6.8
  Top Layer w0.254: U10.34 67.69,26.46 67.69,25.02 67.18,24.51 64.52,24.51 63.88,23.88 R14.1
$1N4046: length 4
  Top Layer w0.254: U10.39 70.23,26.5 70.23,24.51 70.68,24.06 C32.2
$1N4049: length 5.8
  Top Layer w0.254: C33.2 65.91,23.5 66.42,24 67.94,24 68.71,24.77 68.71,26.47 U10.36
$1N4205: length 4.3
  Top Layer w0.254: U10.42 71.74,24.52 72.77,23.5 C31.2
$1N4225: length 5.7
  Top Layer w0.254: C30.2 74.93,22.72 74.93,23.75 74.55,24.13 73.66,24.13 73.24,24.55 U10.45 U10.44
$1N5513: length 7.7
  Top Layer w0.254: U6.8 36.66,19.9 36.32,19.56 34.54,19.56 34.03,19.05 X1.2 34.03,15.56 34.04,15.56
$1N5519: length 5.8
  Top Layer w0.254: 36.58,15.56 36.58,15.56 36.58,17.65 37.16,18.23 U6.9
$1N5854: length 10.7
  Top Layer w0.254: U6.23 44.2,21.04 44.2,19.3 43.94,19.05 40.51,19.05 40.24,18.78 X2.2 40.24,14.4 40,14.16
$1N5860: length 7.1
  Top Layer w0.254: U6.24 44.66,17.46 X2.1 44.45,17.04 C26.2
$1N6160: length 2.8
  Top Layer w0.254: U6.138 31.07,26.17 R2.1
$1N8425: length 4.4
  Top Layer w0.254: U6.109 31.11,44.83 R9.1
$1N8434: length 2.3
  Top Layer w0.254: U6.105 34.67,42.69 R12.1
$1N8625: length 2.5
  Top Layer w0.254: C1.1 U5.8
$1N9988: length 6.6
  Top Layer w0.762: U7.1 12.77,27.98 D1.2
  Top Layer w0.889: D1.2 12.56,27.7 8.76,27.7
$1N9991: length 3.6
  Top Layer w0.254: R6.1 16.39,30.48 R5.2 14.81,30.49 U7.3
$1N10007: length 1.9
  Top Layer w0.254: LED2.2 3.3,35.47 R3.2
$1N10732: length 1.9
  Top Layer w0.254: R1.1 5.98,8.04 LED1.2
$1N10962: length 1.7
  Top Layer w0.254: 63.31,18.42 63.31,16.75 U9.4
$1N11961: length 4.1
  Top Layer w0.254: U14.5 18.67,14.22 18.92,14.48 21.21,14.48 21.34,14.35 21.34,13.78 C39.1
$1N11962: length 9
  Top Layer w0.254: U14.4 v1(20.27,13.73)
  Bottom Layer w0.254: v1(13.67,12.05) 19.92,12.05 20.27,12.4 v1(20.27,13.73)

## Copper pours and planes (outline as drawn; the poured copper is in the pictures)
9V on Top Layer: 14.99,25.91 18.03,25.91 18.03,21.46 14.99,21.46
9V on Top Layer: 15.49,19.38 18.14,19.38 18.14,14.91 15.49,14.91
+5V on Top Layer: 17.14,38.61 20.46,38.61 20.46,37.49 17.14,37.49
+5V on Top Layer: 10.28,37.68 14.2,37.68 14.2,33.88 10.28,33.88
A3V3 on Top Layer: 61.24,26.11 63.25,26.11 63.25,23.75 61.24,23.75
A3V3 on Bottom Layer: 61.24,26.11 63.25,26.11 63.25,23.75 61.24,23.75
AGND on Top Layer: 59.56,63.12 111.89,63.12 111.89,-2.03 59.56,-2.03
AGND on Bottom Layer: 59.56,63.31 115.32,63.31 115.32,-1.84 59.56,-1.84
AVCC on Top Layer: 76.25,41.3 77.09,41.3 77.09,38.1 76.25,38.1
AVCC on Top Layer: 19.46,9.08 24.26,9.08 24.26,6.98 19.46,6.98
AVCC on Top Layer: 66.68,17.02 69.72,17.02 69.72,14.48 66.68,14.48
AVCC on Bottom Layer: 76.25,41.3 77.09,41.3 77.09,38.1 76.25,38.1
AVCC on Bottom Layer: 19.46,9.08 24.26,9.08 24.26,6.98 19.46,6.98
AVCC on Bottom Layer: 66.68,17.02 68.45,17.02 68.45,14.48 66.68,14.48
GND on Top Layer: -2.03,62.1 56.9,62.1 56.9,-2.03 -2.03,-2.03
GND on Bottom Layer: -6.48,62.04 56.77,62.04 56.77,-2.1 -6.48,-2.1
VDD on Top Layer: 24.64,40.77 27.94,40.77 27.94,36.83 24.64,36.83
VDD on Top Layer: 48.28,18.88 53.09,18.88 53.09,17.78 48.28,17.78
VDD on Top Layer: 33.53,41.28 37.34,41.28 37.34,40.51 33.53,40.51
VDD on Bottom Layer: 48.28,18.88 53.09,18.88 53.09,17.78 48.28,17.78
VDD on Bottom Layer: 24.64,39.37 27.94,39.37 27.94,36.83 24.64,36.83
$1N11962 on Top Layer: 12.36,12.52 14.99,12.52 14.99,11.58 12.36,11.58

Small or netless copper shapes (teardrops, artwork), in the pictures only: 255 on Top Layer, 45 on Bottom Layer

## Text on the board
Top Silkscreen Layer: 3V3 1TX 1RX G | 3V3 2TX 2RX G | 3V3 DIO CLK G | CH8 | CH7 | CH6 | CH5 | CH4 | CH3 | CH1 | CH2
